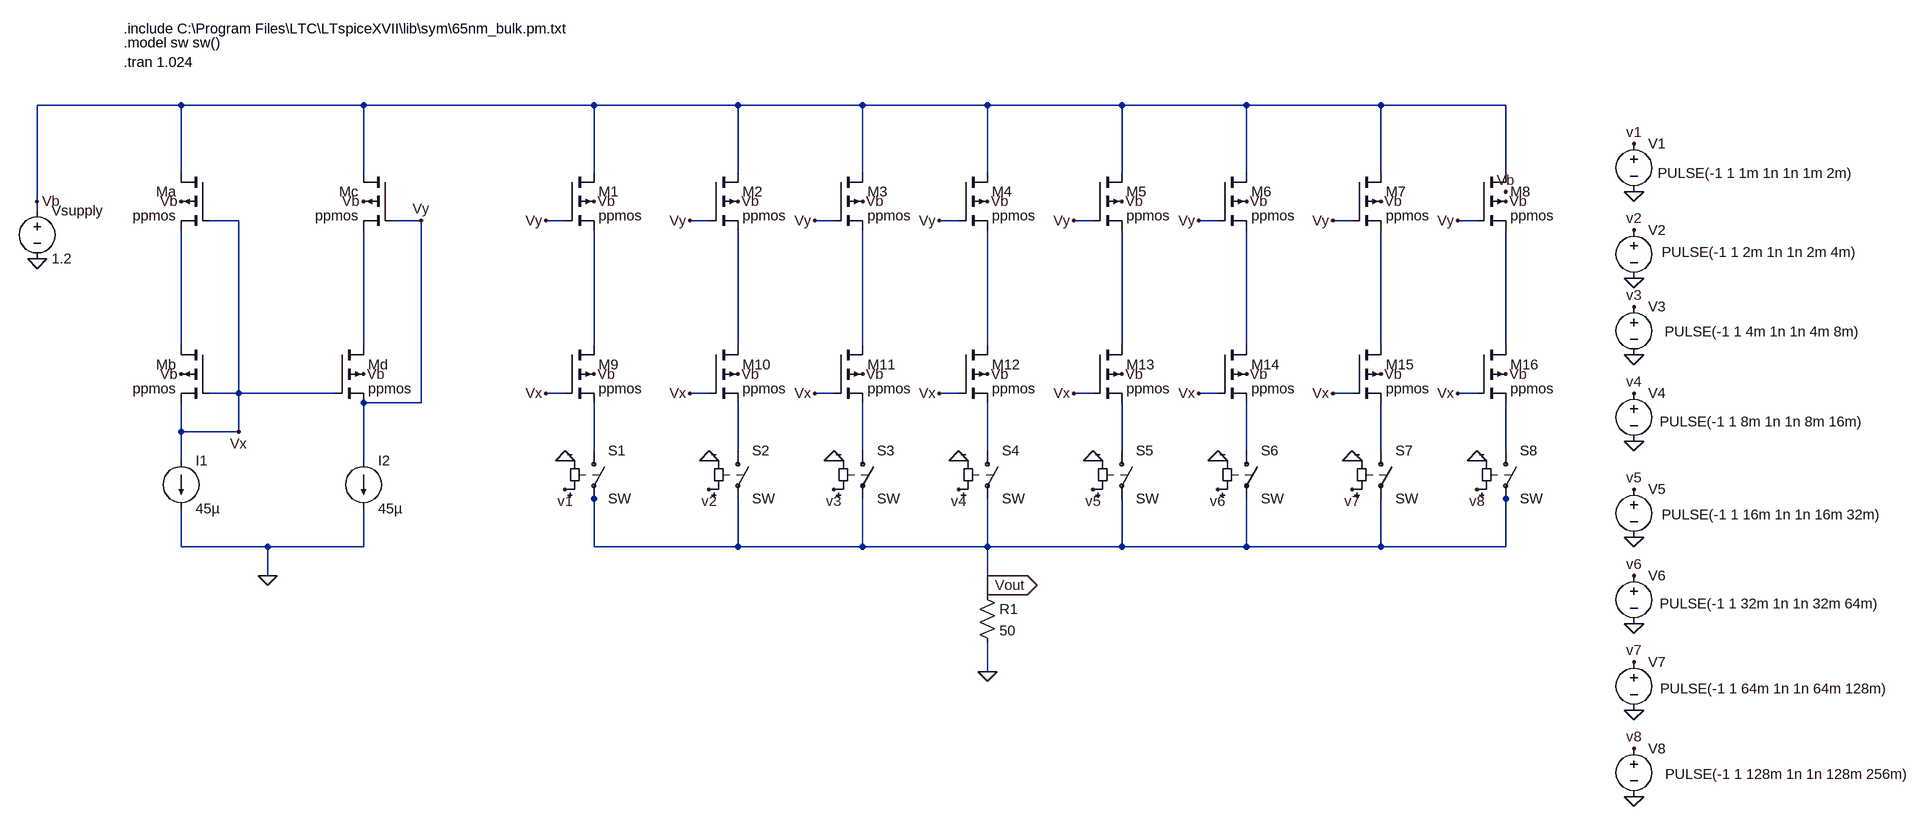
[diagram p0: schematic sooch pmos DAC.asc]
sooch pmos DAC.asc, the LTspice schematic file:
Version 4
SHEET 1 4428 1368
WIRE 0 176 -240 176
WIRE 304 176 0 176
WIRE 688 176 304 176
WIRE 928 176 688 176
WIRE 1136 176 928 176
WIRE 1344 176 1136 176
WIRE 1568 176 1344 176
WIRE 1776 176 1568 176
WIRE 2000 176 1776 176
WIRE 2208 176 2000 176
WIRE 0 288 0 176
WIRE 304 288 304 176
WIRE 688 288 688 176
WIRE 928 288 928 176
WIRE 1136 288 1136 176
WIRE 1344 288 1344 176
WIRE 1568 288 1568 176
WIRE 1776 288 1776 176
WIRE 2000 288 2000 176
WIRE 2208 288 2208 176
WIRE -240 336 -240 176
WIRE -240 352 -240 336
WIRE 96 368 48 368
WIRE 400 368 352 368
WIRE 640 368 608 368
WIRE 880 368 848 368
WIRE 1088 368 1056 368
WIRE 1296 368 1264 368
WIRE 1520 368 1488 368
WIRE 1728 368 1696 368
WIRE 1952 368 1920 368
WIRE 2160 368 2128 368
WIRE 0 576 0 384
WIRE 304 576 304 384
WIRE 688 576 688 384
WIRE 928 576 928 384
WIRE 1136 576 1136 384
WIRE 1344 576 1344 384
WIRE 1568 576 1568 384
WIRE 1776 576 1776 384
WIRE 2000 576 2000 384
WIRE 2208 576 2208 384
WIRE 96 656 96 368
WIRE 96 656 48 656
WIRE 256 656 96 656
WIRE 640 656 608 656
WIRE 880 656 848 656
WIRE 1088 656 1056 656
WIRE 1296 656 1264 656
WIRE 1520 656 1488 656
WIRE 1728 656 1696 656
WIRE 1952 656 1920 656
WIRE 2160 656 2128 656
WIRE 304 672 304 656
WIRE 400 672 400 368
WIRE 400 672 304 672
WIRE 0 720 0 672
WIRE 96 720 96 656
WIRE 96 720 0 720
WIRE 688 752 688 672
WIRE 928 752 928 672
WIRE 1136 752 1136 672
WIRE 1344 752 1344 672
WIRE 1568 752 1568 672
WIRE 1776 752 1776 672
WIRE 2000 752 2000 672
WIRE 2208 752 2208 672
WIRE 0 768 0 720
WIRE 304 768 304 672
WIRE 688 832 688 816
WIRE 2208 832 2208 816
WIRE 0 912 0 848
WIRE 144 912 0 912
WIRE 304 912 304 848
WIRE 304 912 144 912
WIRE 688 912 688 832
WIRE 928 912 928 832
WIRE 928 912 688 912
WIRE 1136 912 1136 832
WIRE 1136 912 928 912
WIRE 1344 912 1344 832
WIRE 1344 912 1136 912
WIRE 1568 912 1568 832
WIRE 1568 912 1344 912
WIRE 1776 912 1776 832
WIRE 1776 912 1568 912
WIRE 2000 912 2000 832
WIRE 2000 912 1776 912
WIRE 2208 912 2208 832
WIRE 2208 912 2000 912
WIRE 144 960 144 912
WIRE 1344 976 1344 912
WIRE 1344 992 1344 976
WIRE 1344 1120 1344 1072
FLAG 144 960 0
FLAG -240 432 0
FLAG 96 720 Vx
FLAG 400 368 Vy
FLAG 608 368 Vy
FLAG 608 656 Vx
FLAG 640 768 0
FLAG 848 368 Vy
FLAG 848 656 Vx
FLAG 880 768 0
FLAG 1056 368 Vy
FLAG 1056 656 Vx
FLAG 1088 768 0
FLAG 1264 368 Vy
FLAG 1264 656 Vx
FLAG 1296 768 0
FLAG 1488 368 Vy
FLAG 1488 656 Vx
FLAG 1520 768 0
FLAG 1696 368 Vy
FLAG 1696 656 Vx
FLAG 1728 768 0
FLAG 1920 368 Vy
FLAG 1920 656 Vx
FLAG 1952 768 0
FLAG 2128 368 Vy
FLAG 2128 656 Vx
FLAG 2160 768 0
FLAG 1344 1120 0
FLAG 3232 240 v1
FLAG 640 816 v1
FLAG 3232 384 v2
FLAG 880 816 v2
FLAG 1088 816 v3
FLAG 1296 816 v4
FLAG 1520 816 v5
FLAG 1728 816 v6
FLAG 1952 816 v7
FLAG 2160 816 v8
FLAG 3232 512 v3
FLAG 3232 656 v4
FLAG 3232 816 v5
FLAG 3232 960 v6
FLAG 3232 1104 v7
FLAG 3232 1248 v8
FLAG 3232 320 0
FLAG 3232 464 0
FLAG 3232 592 0
FLAG 3232 736 0
FLAG 3232 896 0
FLAG 3232 1040 0
FLAG 3232 1184 0
FLAG 3232 1328 0
FLAG -240 336 Vb
FLAG 0 336 Vb
FLAG 304 336 Vb
FLAG 304 624 Vb
FLAG 0 624 Vb
FLAG 688 336 Vb
FLAG 688 624 Vb
FLAG 928 336 Vb
FLAG 1136 336 Vb
FLAG 1344 336 Vb
FLAG 1568 336 Vb
FLAG 1776 336 Vb
FLAG 2000 336 Vb
FLAG 2208 320 Vb
FLAG 2208 336 Vb
FLAG 2208 624 Vb
FLAG 2000 624 Vb
FLAG 1776 624 Vb
FLAG 1568 624 Vb
FLAG 1344 624 Vb
FLAG 1136 624 Vb
FLAG 928 624 Vb
FLAG 1344 976 Vout
IOPIN 1344 976 Out
SYMBOL pmos4 48 288 M0
SYMATTR InstName Ma
SYMATTR Value ppmos
SYMATTR Value2 l=0.3u w=1u
SYMBOL pmos4 352 288 M0
SYMATTR InstName Mc
SYMATTR Value ppmos
SYMATTR Value2 l=0.3u w=3u
SYMBOL pmos4 48 576 M0
SYMATTR InstName Mb
SYMATTR Value ppmos
SYMATTR Value2 l=0.3u w=3u
SYMBOL pmos4 256 576 R0
SYMATTR InstName Md
SYMATTR Value ppmos
SYMATTR Value2 l=0.3u w=3u
SYMBOL current 0 768 R0
WINDOW 123 0 0 Left 0
WINDOW 39 0 0 Left 0
SYMATTR InstName I1
SYMATTR Value 45µ
SYMBOL current 304 768 R0
WINDOW 123 0 0 Left 0
WINDOW 39 0 0 Left 0
SYMATTR InstName I2
SYMATTR Value 45µ
SYMBOL voltage -240 336 R0
WINDOW 123 0 0 Left 0
WINDOW 39 0 0 Left 0
SYMATTR InstName Vsupply
SYMATTR Value 1.2
SYMBOL pmos4 640 288 R0
SYMATTR InstName M1
SYMATTR Value ppmos
SYMATTR Value2 l=0.3u w=3u m=1
SYMBOL pmos4 640 576 R0
SYMATTR InstName M9
SYMATTR Value ppmos
SYMATTR Value2 l=0.3u w=3u m=1
SYMBOL sw 688 736 R0
SYMATTR InstName S1
SYMBOL pmos4 880 288 R0
SYMATTR InstName M2
SYMATTR Value ppmos
SYMATTR Value2 l=0.3u w=3u m=2
SYMBOL pmos4 880 576 R0
SYMATTR InstName M10
SYMATTR Value ppmos
SYMATTR Value2 l=0.3u w=3u m=2
SYMBOL sw 928 736 R0
SYMATTR InstName S2
SYMBOL pmos4 1088 288 R0
SYMATTR InstName M3
SYMATTR Value ppmos
SYMATTR Value2 l=0.3u w=3u m=4
SYMBOL pmos4 1088 576 R0
SYMATTR InstName M11
SYMATTR Value ppmos
SYMATTR Value2 l=0.3u w=3u m=4
SYMBOL sw 1136 736 R0
SYMATTR InstName S3
SYMBOL pmos4 1296 288 R0
SYMATTR InstName M4
SYMATTR Value ppmos
SYMATTR Value2 l=0.3u w=3u m=8
SYMBOL pmos4 1296 576 R0
SYMATTR InstName M12
SYMATTR Value ppmos
SYMATTR Value2 l=0.3u w=3u m=8
SYMBOL sw 1344 736 R0
SYMATTR InstName S4
SYMBOL pmos4 1520 288 R0
SYMATTR InstName M5
SYMATTR Value ppmos
SYMATTR Value2 l=0.3u w=3u m=16
SYMBOL pmos4 1520 576 R0
SYMATTR InstName M13
SYMATTR Value ppmos
SYMATTR Value2 l=0.3u w=3u m=16
SYMBOL sw 1568 736 R0
SYMATTR InstName S5
SYMBOL pmos4 1728 288 R0
SYMATTR InstName M6
SYMATTR Value ppmos
SYMATTR Value2 l=0.3u w=3u m=32
SYMBOL pmos4 1728 576 R0
SYMATTR InstName M14
SYMATTR Value ppmos
SYMATTR Value2 l=0.3u w=3u m=32
SYMBOL sw 1776 736 R0
SYMATTR InstName S6
SYMBOL pmos4 1952 288 R0
SYMATTR InstName M7
SYMATTR Value ppmos
SYMATTR Value2 l=0.3u w=3u m=64
SYMBOL pmos4 1952 576 R0
SYMATTR InstName M15
SYMATTR Value ppmos
SYMATTR Value2 l=0.3u w=3u m=64
SYMBOL sw 2000 736 R0
SYMATTR InstName S7
SYMBOL pmos4 2160 288 R0
SYMATTR InstName M8
SYMATTR Value ppmos
SYMATTR Value2 l=0.3u w=3u m=128
SYMBOL pmos4 2160 576 R0
SYMATTR InstName M16
SYMATTR Value ppmos
SYMATTR Value2 l=0.3u w=3u m=128
SYMBOL sw 2208 736 R0
SYMATTR InstName S8
SYMBOL res 1328 976 R0
SYMATTR InstName R1
SYMATTR Value 50
SYMBOL voltage 3232 224 R0
WINDOW 3 40 65 Left 2
WINDOW 123 0 0 Left 0
WINDOW 39 0 0 Left 0
SYMATTR Value PULSE(-1 1 1m 1n 1n 1m 2m)
SYMATTR InstName V1
SYMBOL voltage 3232 368 R0
WINDOW 3 46 53 Left 2
WINDOW 123 0 0 Left 0
WINDOW 39 0 0 Left 0
SYMATTR Value PULSE(-1 1 2m 1n 1n 2m 4m)
SYMATTR InstName V2
SYMBOL voltage 3232 496 R0
WINDOW 123 0 0 Left 0
WINDOW 39 0 0 Left 0
WINDOW 3 51 57 Left 2
SYMATTR Value PULSE(-1 1 4m 1n 1n 4m 8m)
SYMATTR InstName V3
SYMBOL voltage 3232 640 R0
WINDOW 123 0 0 Left 0
WINDOW 39 0 0 Left 0
WINDOW 3 43 63 Left 2
SYMATTR Value PULSE(-1 1 8m 1n 1n 8m 16m)
SYMATTR InstName V4
SYMBOL voltage 3232 800 R0
WINDOW 123 0 0 Left 0
WINDOW 39 0 0 Left 0
WINDOW 3 46 58 Left 2
SYMATTR Value PULSE(-1 1 16m 1n 1n 16m 32m)
SYMATTR InstName V5
SYMBOL voltage 3232 944 R0
WINDOW 123 0 0 Left 0
WINDOW 39 0 0 Left 0
WINDOW 3 43 63 Left 2
SYMATTR Value PULSE(-1 1 32m 1n 1n 32m 64m)
SYMATTR InstName V6
SYMBOL voltage 3232 1088 R0
WINDOW 123 0 0 Left 0
WINDOW 39 0 0 Left 0
WINDOW 3 44 60 Left 2
SYMATTR Value PULSE(-1 1 64m 1n 1n 64m 128m)
SYMATTR InstName V7
SYMBOL voltage 3232 1232 R0
WINDOW 123 0 0 Left 0
WINDOW 39 0 0 Left 0
WINDOW 3 52 59 Left 2
SYMATTR Value PULSE(-1 1 128m 1n 1n 128m 256m)
SYMATTR InstName V8
TEXT -96 48 Left 2 !.include C:\\Program Files\\LTC\\LTspiceXVII\\lib\\sym\\65nm_bulk.pm.txt
TEXT -96 72 Left 2 !.model sw sw()
TEXT -96 104 Left 2 !.tran 1.024

The netlist it stands for:
* sooch pmos DAC.asc
Ma Vb Vx N001 Vb ppmos l=0.3u w=1u
Mc Vb Vy N002 Vb ppmos l=0.3u w=3u
Mb N001 Vx Vx Vb ppmos l=0.3u w=3u
Md N002 Vx Vy Vb ppmos l=0.3u w=3u
I1 Vx 0 45µ
I2 Vy 0 45µ
Vsupply Vb 0 1.2
M1 Vb Vy N003 Vb ppmos l=0.3u w=3u m=1
M9 N003 Vx N011 Vb ppmos l=0.3u w=3u m=1
S1 N011 Vout v1 0 SW
M2 Vb Vy N004 Vb ppmos l=0.3u w=3u m=2
M10 N004 Vx N012 Vb ppmos l=0.3u w=3u m=2
S2 N012 Vout v2 0 SW
M3 Vb Vy N005 Vb ppmos l=0.3u w=3u m=4
M11 N005 Vx N013 Vb ppmos l=0.3u w=3u m=4
S3 N013 Vout v3 0 SW
M4 Vb Vy N006 Vb ppmos l=0.3u w=3u m=8
M12 N006 Vx N014 Vb ppmos l=0.3u w=3u m=8
S4 N014 Vout v4 0 SW
M5 Vb Vy N007 Vb ppmos l=0.3u w=3u m=16
M13 N007 Vx N015 Vb ppmos l=0.3u w=3u m=16
S5 N015 Vout v5 0 SW
M6 Vb Vy N008 Vb ppmos l=0.3u w=3u m=32
M14 N008 Vx N016 Vb ppmos l=0.3u w=3u m=32
S6 N016 Vout v6 0 SW
M7 Vb Vy N009 Vb ppmos l=0.3u w=3u m=64
M15 N009 Vx N017 Vb ppmos l=0.3u w=3u m=64
S7 N017 Vout v7 0 SW
M8 Vb Vy N010 Vb ppmos l=0.3u w=3u m=128
M16 N010 Vx N018 Vb ppmos l=0.3u w=3u m=128
S8 N018 Vout v8 0 SW
R1 Vout 0 50
V1 v1 0 PULSE(-1 1 1m 1n 1n 1m 2m)
V2 v2 0 PULSE(-1 1 2m 1n 1n 2m 4m)
V3 v3 0 PULSE(-1 1 4m 1n 1n 4m 8m)
V4 v4 0 PULSE(-1 1 8m 1n 1n 8m 16m)
V5 v5 0 PULSE(-1 1 16m 1n 1n 16m 32m)
V6 v6 0 PULSE(-1 1 32m 1n 1n 32m 64m)
V7 v7 0 PULSE(-1 1 64m 1n 1n 64m 128m)
V8 v8 0 PULSE(-1 1 128m 1n 1n 128m 256m)
.model NMOS NMOS
.model PMOS PMOS
.lib standard.mos
.include C:\Program Files\LTC\LTspiceXVII\lib\sym\65nm_bulk.pm.txt
.model sw sw()
.tran 1.024
.backanno
.end